# EAGLE design sensor-board_v1_23 (EAGLE 7.6.0)
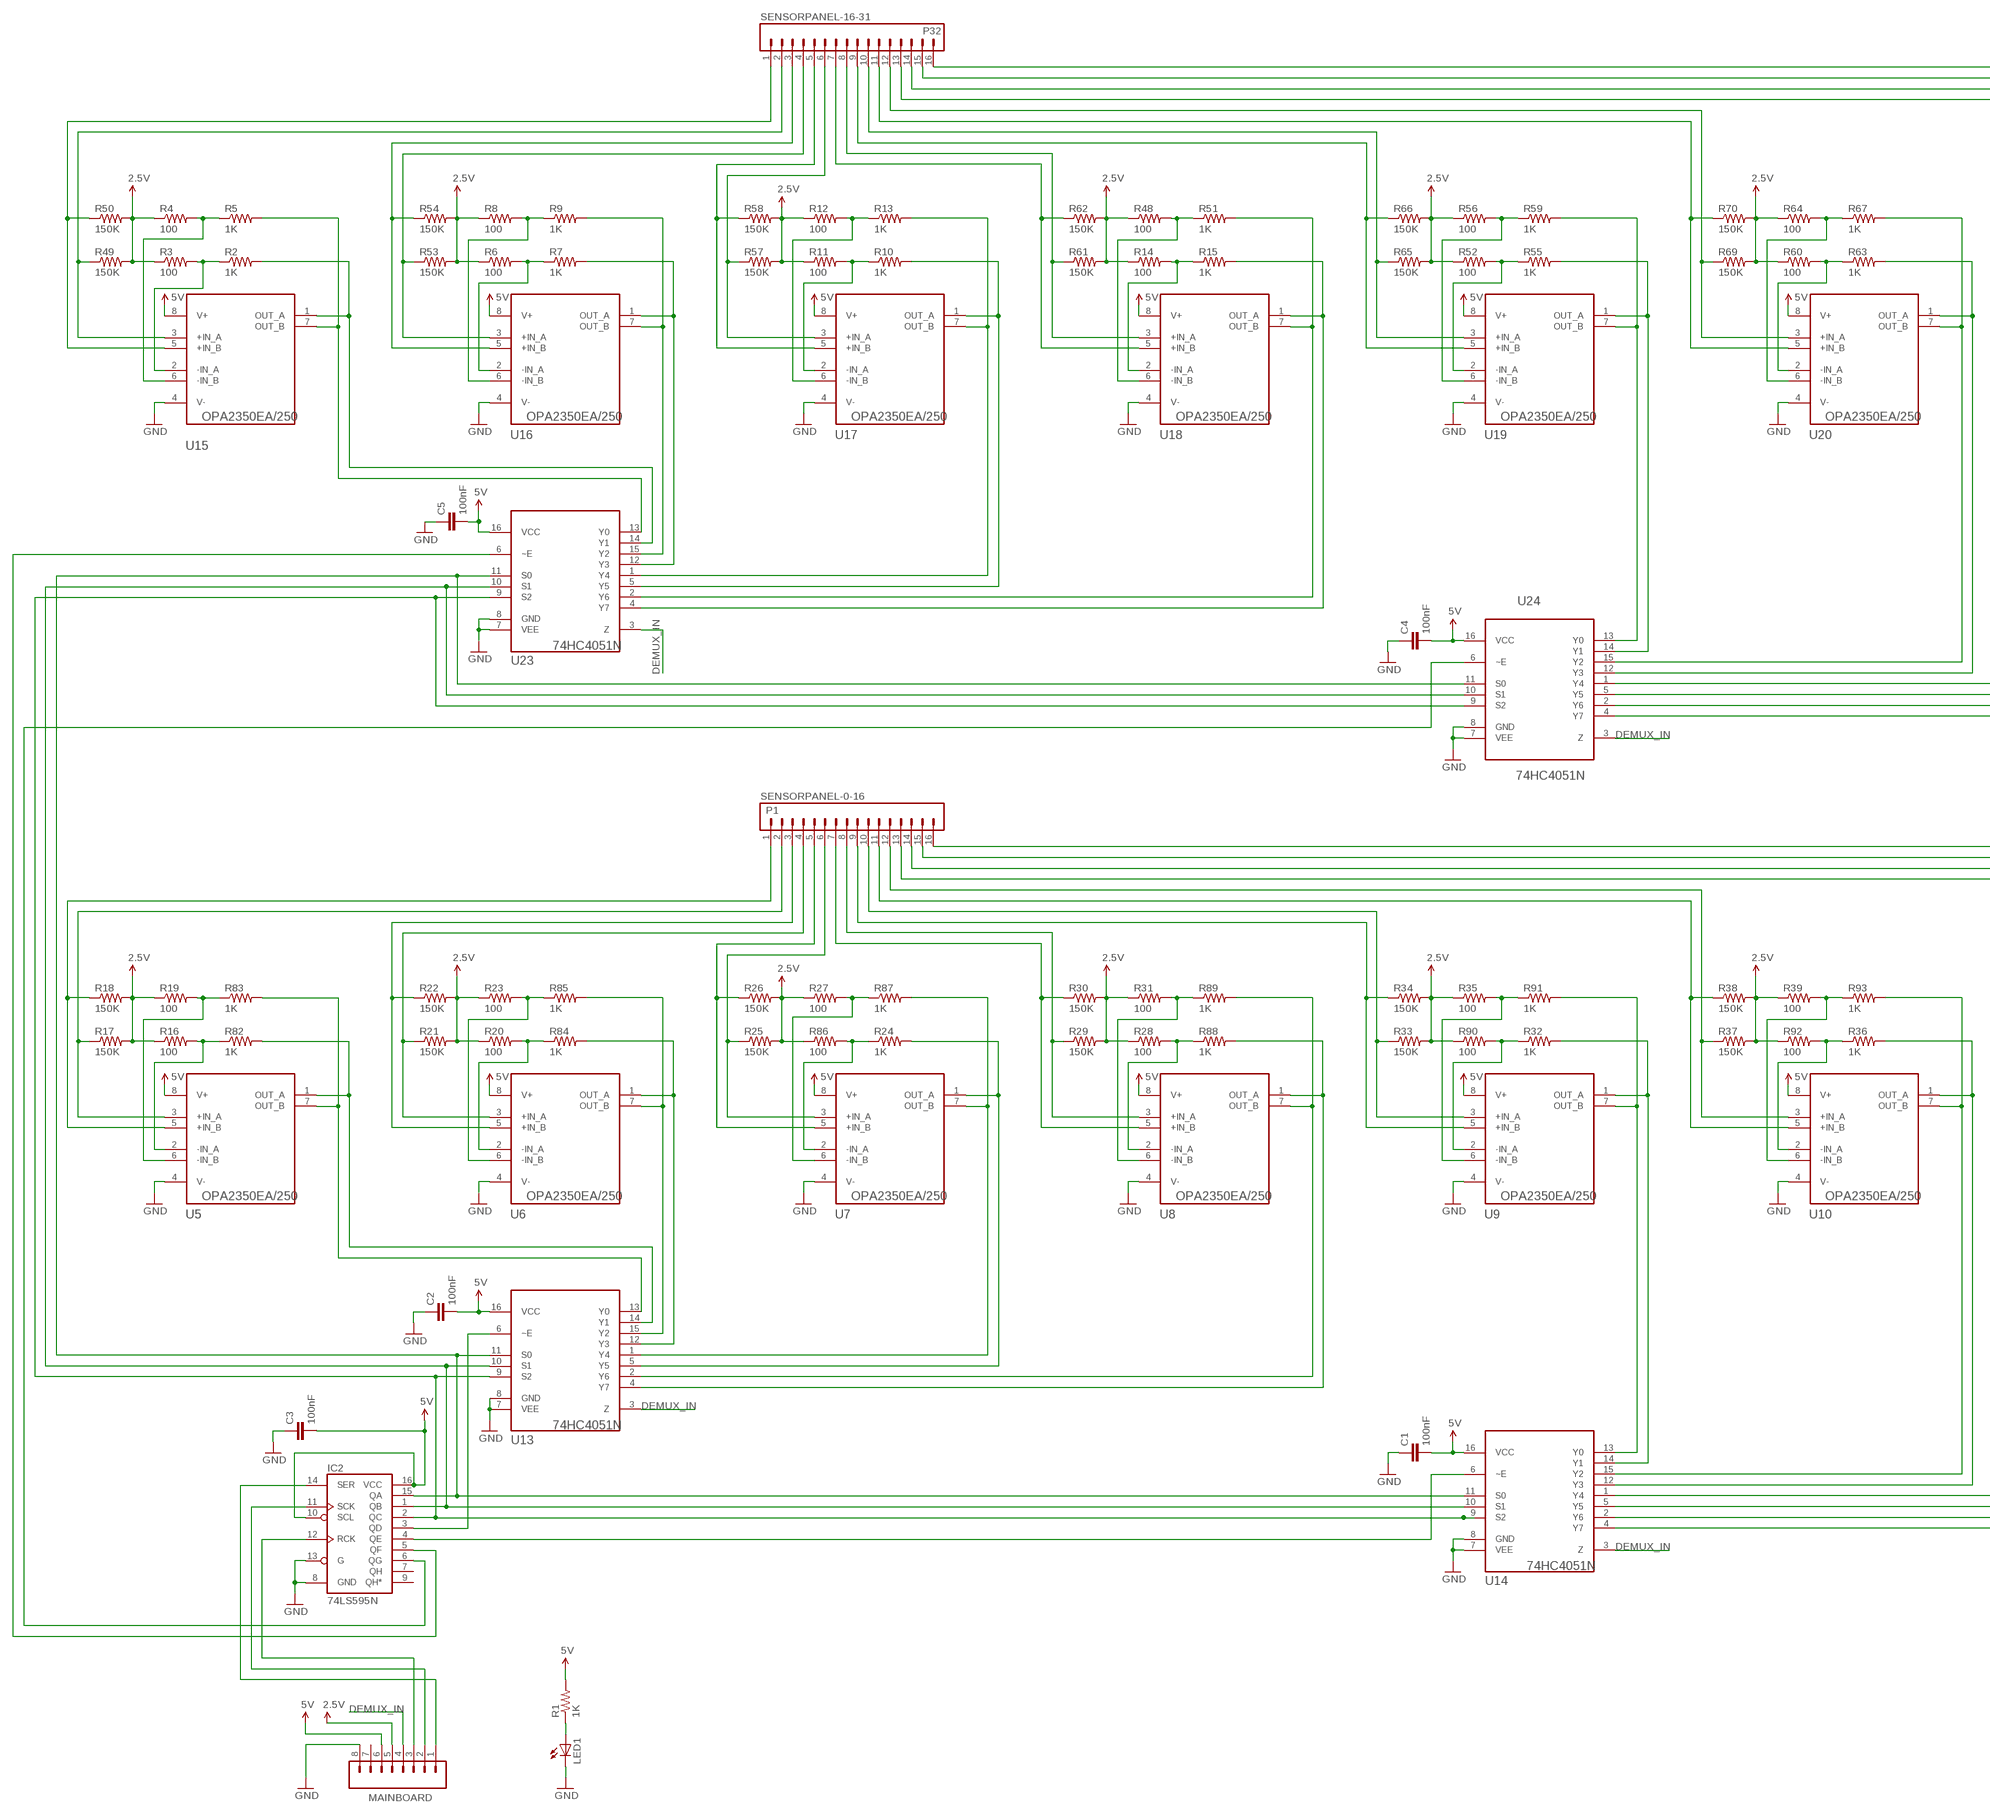
[diagram p0: schematic, sheet 1, part 1 of 2]
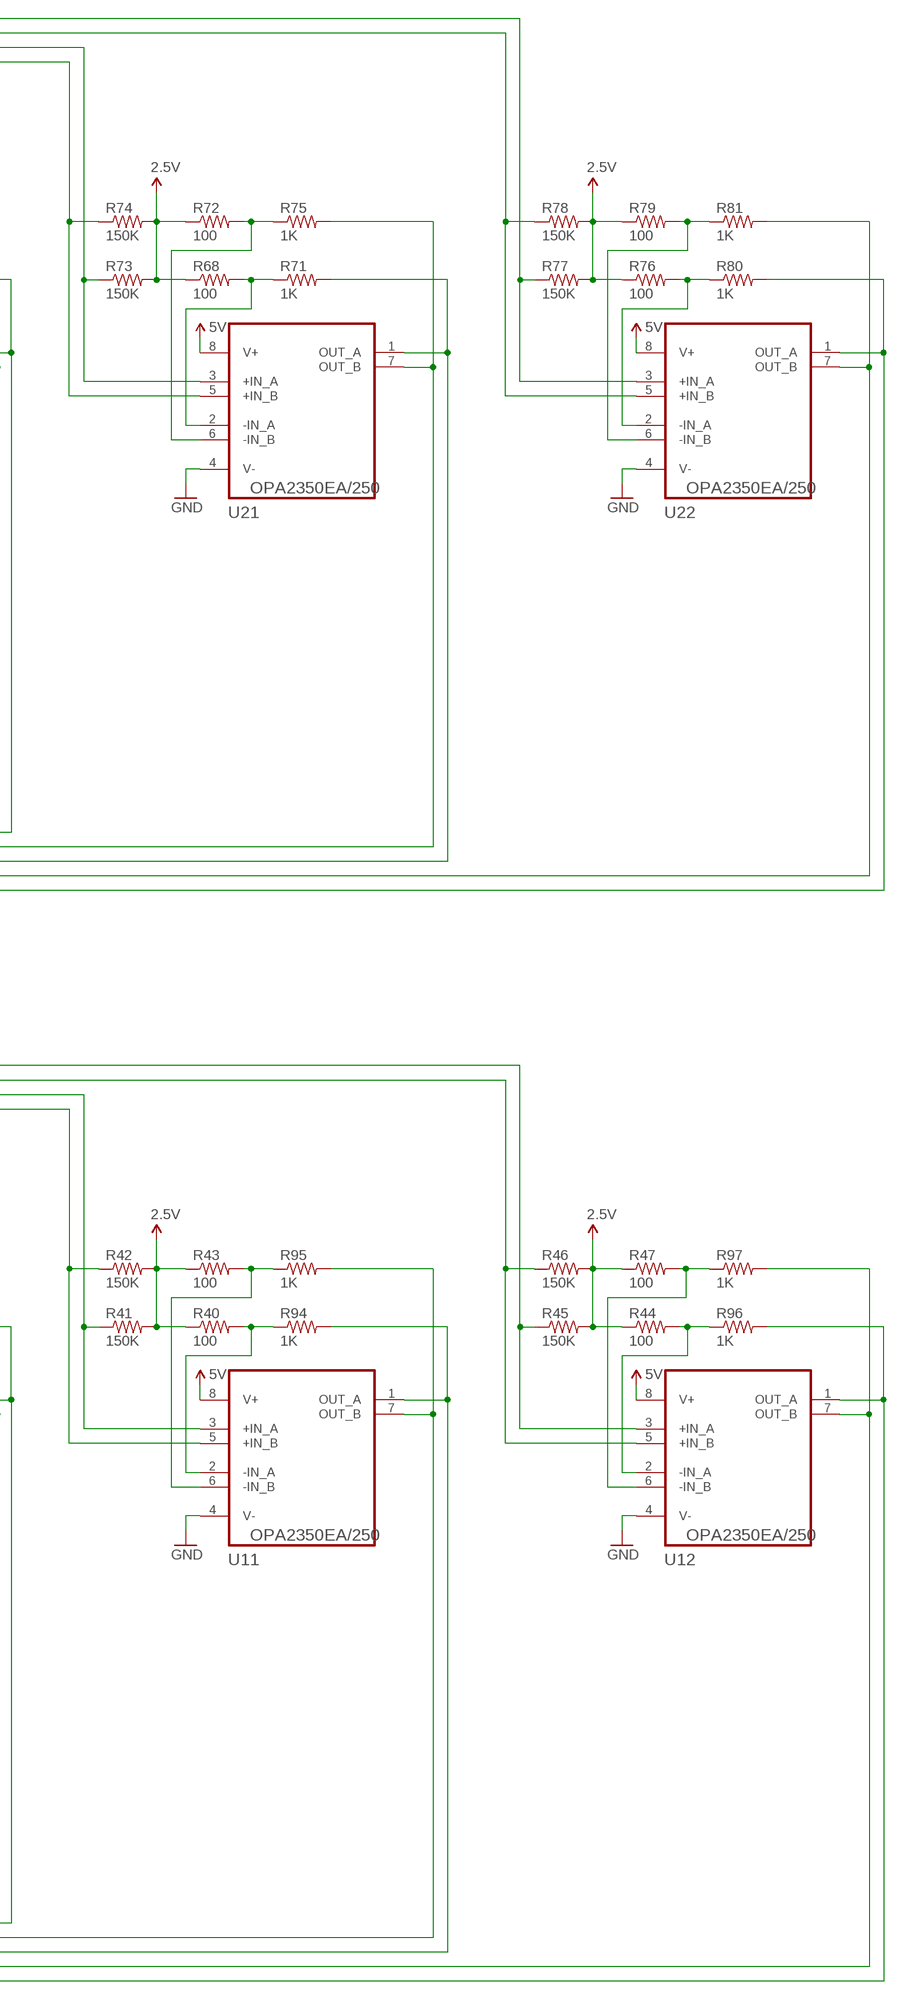
[diagram p1: schematic, sheet 1, part 2 of 2]

## Parts
C1  100nF  CAPPTH  [CAP-PTH-SMALL]
C2  100nF  CAPPTH  [CAP-PTH-SMALL]
C3  100nF  CAPPTH  [CAP-PTH-SMALL]
C4  100nF  CAPPTH  [CAP-PTH-SMALL]
C5  100nF  CAPPTH  [CAP-PTH-SMALL]
IC2  74LS595N  [DIL16]
LED1  LED0603  [LED-0603]
MAINBOARD  M08LONGPADS  [1X08_LONGPADS]
R1  1K  RESISTOR0805-RES  [0805]
R2  1K  RESISTOR0805-RES  [0805]
R3  100  RESISTOR0805-RES  [0805]
R4  100  RESISTOR0805-RES  [0805]
R5  1K  RESISTOR0805-RES  [0805]
R6  100  RESISTOR0805-RES  [0805]
R7  1K  RESISTOR0805-RES  [0805]
R8  100  RESISTOR0805-RES  [0805]
R9  1K  RESISTOR0805-RES  [0805]
R10  1K  RESISTOR0805-RES  [0805]
R11  100  RESISTOR0805-RES  [0805]
R12  100  RESISTOR0805-RES  [0805]
R13  1K  RESISTOR0805-RES  [0805]
R14  100  RESISTOR0805-RES  [0805]
R15  1K  RESISTOR0805-RES  [0805]
R16  100  RESISTOR0805-RES  [0805]
R17  150K  RESISTOR0805-RES  [0805]
R18  150K  RESISTOR0805-RES  [0805]
R19  100  RESISTOR0805-RES  [0805]
R20  100  RESISTOR0805-RES  [0805]
R21  150K  RESISTOR0805-RES  [0805]
R22  150K  RESISTOR0805-RES  [0805]
R23  100  RESISTOR0805-RES  [0805]
R24  1K  RESISTOR0805-RES  [0805]
R25  150K  RESISTOR0805-RES  [0805]
R26  150K  RESISTOR0805-RES  [0805]
R27  100  RESISTOR0805-RES  [0805]
R28  100  RESISTOR0805-RES  [0805]
R29  150K  RESISTOR0805-RES  [0805]
R30  150K  RESISTOR0805-RES  [0805]
R31  100  RESISTOR0805-RES  [0805]
R32  1K  RESISTOR0805-RES  [0805]
R33  150K  RESISTOR0805-RES  [0805]
R34  150K  RESISTOR0805-RES  [0805]
R35  100  RESISTOR0805-RES  [0805]
R36  1K  RESISTOR0805-RES  [0805]
R37  150K  RESISTOR0805-RES  [0805]
R38  150K  RESISTOR0805-RES  [0805]
R39  100  RESISTOR0805-RES  [0805]
R40  100  RESISTOR0805-RES  [0805]
R41  150K  RESISTOR0805-RES  [0805]
R42  150K  RESISTOR0805-RES  [0805]
R43  100  RESISTOR0805-RES  [0805]
R44  100  RESISTOR0805-RES  [0805]
R45  150K  RESISTOR0805-RES  [0805]
R46  150K  RESISTOR0805-RES  [0805]
R47  100  RESISTOR0805-RES  [0805]
R48  100  RESISTOR0805-RES  [0805]
R49  150K  RESISTOR0805-RES  [0805]
R50  150K  RESISTOR0805-RES  [0805]
R51  1K  RESISTOR0805-RES  [0805]
R52  100  RESISTOR0805-RES  [0805]
R53  150K  RESISTOR0805-RES  [0805]
R54  150K  RESISTOR0805-RES  [0805]
R55  1K  RESISTOR0805-RES  [0805]
R56  100  RESISTOR0805-RES  [0805]
R57  150K  RESISTOR0805-RES  [0805]
R58  150K  RESISTOR0805-RES  [0805]
R59  1K  RESISTOR0805-RES  [0805]
R60  100  RESISTOR0805-RES  [0805]
R61  150K  RESISTOR0805-RES  [0805]
R62  150K  RESISTOR0805-RES  [0805]
R63  1K  RESISTOR0805-RES  [0805]
R64  100  RESISTOR0805-RES  [0805]
R65  150K  RESISTOR0805-RES  [0805]
R66  150K  RESISTOR0805-RES  [0805]
R67  1K  RESISTOR0805-RES  [0805]
R68  100  RESISTOR0805-RES  [0805]
R69  150K  RESISTOR0805-RES  [0805]
R70  150K  RESISTOR0805-RES  [0805]
R71  1K  RESISTOR0805-RES  [0805]
R72  100  RESISTOR0805-RES  [0805]
R73  150K  RESISTOR0805-RES  [0805]
R74  150K  RESISTOR0805-RES  [0805]
R75  1K  RESISTOR0805-RES  [0805]
R76  100  RESISTOR0805-RES  [0805]
R77  150K  RESISTOR0805-RES  [0805]
R78  150K  RESISTOR0805-RES  [0805]
R79  100  RESISTOR0805-RES  [0805]
R80  1K  RESISTOR0805-RES  [0805]
R81  1K  RESISTOR0805-RES  [0805]
R82  1K  RESISTOR0805-RES  [0805]
R83  1K  RESISTOR0805-RES  [0805]
R84  1K  RESISTOR0805-RES  [0805]
R85  1K  RESISTOR0805-RES  [0805]
R86  100  RESISTOR0805-RES  [0805]
R87  1K  RESISTOR0805-RES  [0805]
R88  1K  RESISTOR0805-RES  [0805]
R89  1K  RESISTOR0805-RES  [0805]
R90  100  RESISTOR0805-RES  [0805]
R91  1K  RESISTOR0805-RES  [0805]
R92  100  RESISTOR0805-RES  [0805]
R93  1K  RESISTOR0805-RES  [0805]
R94  1K  RESISTOR0805-RES  [0805]
R95  1K  RESISTOR0805-RES  [0805]
R96  1K  RESISTOR0805-RES  [0805]
R97  1K  RESISTOR0805-RES  [0805]
SENSORPANEL-0-16  P1  M16LOCK  [1X16_LOCK]
SENSORPANEL-16-31  P32  M16LOCK  [1X16_LOCK]
U5  OPA2350EA/250  [SOP65P490X110-8N]
U6  OPA2350EA/250  [SOP65P490X110-8N]
U7  OPA2350EA/250  [SOP65P490X110-8N]
U8  OPA2350EA/250  [SOP65P490X110-8N]
U9  OPA2350EA/250  [SOP65P490X110-8N]
U10  OPA2350EA/250  [SOP65P490X110-8N]
U11  OPA2350EA/250  [SOP65P490X110-8N]
U12  OPA2350EA/250  [SOP65P490X110-8N]
U13  74HC4051N  [DIP254P762X420-16]
U14  74HC4051N  [DIP254P762X420-16]
U15  OPA2350EA/250  [SOP65P490X110-8N]
U16  OPA2350EA/250  [SOP65P490X110-8N]
U17  OPA2350EA/250  [SOP65P490X110-8N]
U18  OPA2350EA/250  [SOP65P490X110-8N]
U19  OPA2350EA/250  [SOP65P490X110-8N]
U20  OPA2350EA/250  [SOP65P490X110-8N]
U21  OPA2350EA/250  [SOP65P490X110-8N]
U22  OPA2350EA/250  [SOP65P490X110-8N]
U23  74HC4051N  [DIP254P762X420-16]
U24  74HC4051N  [DIP254P762X420-16]

## Nets
2.8V: MAINBOARD.5 R3.1 R4.1 R6.1 R8.1 R11.1 R12.1 R14.1 R16.1 R17.2 R18.2 R19.1 R20.1 R21.2 R22.2 R23.1 R25.2 R26.2 R27.1 R28.1 R29.2 R30.2 R31.1 R33.2 R34.2 R35.1 R37.2 R38.2 R39.1 R40.1 R41.2 R42.2 R43.1 R44.1 R45.2 R46.2 R47.1 R48.1 R49.2 R50.2 R52.1 R53.2 R54.2 R56.1 R57.2 R58.2 R60.1 R61.2 R62.2 R64.1 R65.2 R66.2 R68.1 R69.2 R70.2 R72.1 R73.2 R74.2 R76.1 R77.2 R78.2 R79.1 R86.1 R90.1 R92.1 ; supply symbol labelled 2.5V
5V: C1.2 C2.2 C3.2 C4.2 C5.2 IC2.10(SCL) IC2.16(VCC) MAINBOARD.6 R1.2 U5.8(V+) U6.8(V+) U7.8(V+) U8.8(V+) U9.8(V+) U10.8(V+) U11.8(V+) U12.8(V+) U13.16(VCC) U14.16(VCC) U15.8(V+) U16.8(V+) U17.8(V+) U18.8(V+) U19.8(V+) U20.8(V+) U21.8(V+) U22.8(V+) U23.16(VCC) U24.16(VCC)
DEMUX_IN: MAINBOARD.4 U13.3(Z) U14.3(Z) U23.3(Z) U24.3(Z)
GND: C1.1 C2.1 C3.1 C4.1 C5.1 IC2.8(GND) IC2.13(G) LED1.C MAINBOARD.8 U5.4(V-) U6.4(V-) U7.4(V-) U8.4(V-) U9.4(V-) U10.4(V-) U11.4(V-) U12.4(V-) U13.7(VEE) U13.8(GND) U14.7(VEE) U14.8(GND) U15.4(V-) U16.4(V-) U17.4(V-) U18.4(V-) U19.4(V-) U20.4(V-) U21.4(V-) U22.4(V-) U23.7(VEE) U23.8(GND) U24.7(VEE) U24.8(GND)
N$1: LED1.A R1.1
N$2: R2.1 R3.2 U15.2(-IN_A)
N$3: R4.2 R5.1 U15.6(-IN_B)
N$4: R6.2 R7.1 U16.2(-IN_A)
N$5: R8.2 R9.1 U16.6(-IN_B)
N$6: R10.1 R11.2 U17.2(-IN_A)
N$7: R12.2 R13.1 U17.6(-IN_B)
N$8: R14.2 R15.1 U18.2(-IN_A)
N$9: R48.2 R51.1 U18.6(-IN_B)
N$10: R52.2 R55.1 U19.2(-IN_A)
N$11: R56.2 R59.1 U19.6(-IN_B)
N$12: R60.2 R63.1 U20.2(-IN_A)
N$13: R64.2 R67.1 U20.6(-IN_B)
N$14: R68.2 R71.1 U21.2(-IN_A)
N$15: R72.2 R75.1 U21.6(-IN_B)
N$16: R76.2 R80.1 U22.2(-IN_A)
N$17: R79.2 R81.1 U22.6(-IN_B)
N$18: R16.2 R82.1 U5.2(-IN_A)
N$19: R19.2 R83.1 U5.6(-IN_B)
N$20: R20.2 R84.1 U6.2(-IN_A)
N$21: R23.2 R85.1 U6.6(-IN_B)
N$22: R24.1 R86.2 U7.2(-IN_A)
N$23: R27.2 R87.1 U7.6(-IN_B)
N$24: R82.2 U5.1(OUT_A) U13.14(Y1)
N$25: R83.2 U5.7(OUT_B) U13.13(Y0)
N$26: R84.2 U6.1(OUT_A) U13.12(Y3)
N$27: R28.2 R88.1 U8.2(-IN_A)
N$28: R17.1 SENSORPANEL-0-16.2 U5.3(+IN_A)
N$29: R18.1 SENSORPANEL-0-16.1 U5.5(+IN_B)
N$30: R31.2 R89.1 U8.6(-IN_B)
N$31: R85.2 U6.7(OUT_B) U13.15(Y2)
N$32: R32.1 R90.2 U9.2(-IN_A)
N$33: R21.1 SENSORPANEL-0-16.4 U6.3(+IN_A)
N$34: R22.1 SENSORPANEL-0-16.3 U6.5(+IN_B)
N$35: R35.2 R91.1 U9.6(-IN_B)
N$36: R24.2 U7.1(OUT_A) U13.5(Y5)
N$37: R87.2 U7.7(OUT_B) U13.1(Y4)
N$38: R36.1 R92.2 U10.2(-IN_A)
N$39: R25.1 SENSORPANEL-0-16.6 U7.3(+IN_A)
N$40: R26.1 SENSORPANEL-0-16.5 U7.5(+IN_B)
N$41: R39.2 R93.1 U10.6(-IN_B)
N$42: R88.2 U8.1(OUT_A) U13.4(Y7)
N$43: R89.2 U8.7(OUT_B) U13.2(Y6)
N$44: R40.2 R94.1 U11.2(-IN_A)
N$45: R32.2 U9.1(OUT_A) U14.14(Y1)
N$46: R30.1 SENSORPANEL-0-16.7 U8.5(+IN_B)
N$47: R44.2 R96.1 U12.2(-IN_A)
N$48: R29.1 SENSORPANEL-0-16.8 U8.3(+IN_A)
N$49: R91.2 U9.7(OUT_B) U14.13(Y0)
N$50: R47.2 R97.1 U12.6(-IN_B)
N$51: R34.1 SENSORPANEL-0-16.9 U9.5(+IN_B)
N$53: R33.1 SENSORPANEL-0-16.10 U9.3(+IN_A)
N$54: R36.2 U10.1(OUT_A) U14.12(Y3)
N$55: R93.2 U10.7(OUT_B) U14.15(Y2)
N$57: R38.1 SENSORPANEL-0-16.11 U10.5(+IN_B)
N$59: R37.1 SENSORPANEL-0-16.12 U10.3(+IN_A)
N$60: R94.2 U11.1(OUT_A) U14.5(Y5)
N$61: R95.2 U11.7(OUT_B) U14.1(Y4)
N$63: R42.1 SENSORPANEL-0-16.13 U11.5(+IN_B)
N$64: R43.2 R95.1 U11.6(-IN_B)
N$65: R41.1 SENSORPANEL-0-16.14 U11.3(+IN_A)
N$66: R96.2 U12.1(OUT_A) U14.4(Y7)
N$67: R97.2 U12.7(OUT_B) U14.2(Y6)
N$69: R46.1 SENSORPANEL-0-16.15 U12.5(+IN_B)
N$71: R45.1 SENSORPANEL-0-16.16 U12.3(+IN_A)
N$72: R2.2 U15.1(OUT_A) U23.14(Y1)
N$73: IC2.15(QA) U13.11(S0) U14.11(S0) U23.11(S0) U24.11(S0)
N$74: IC2.1(QB) U13.10(S1) U14.10(S1) U23.10(S1) U24.10(S1)
N$75: IC2.2(QC) U13.9(S2) U14.9(S2) U23.9(S2) U24.9(S2)
N$76: IC2.3(QD) U13.6(~E)
N$77: IC2.4(QE) U14.6(~E)
N$78: R5.2 U15.7(OUT_B) U23.13(Y0)
N$80: R49.1 SENSORPANEL-16-31.2 U15.3(+IN_A)
N$81: R50.1 SENSORPANEL-16-31.1 U15.5(+IN_B)
N$83: R7.2 U16.1(OUT_A) U23.12(Y3)
N$84: R9.2 U16.7(OUT_B) U23.15(Y2)
N$86: R53.1 SENSORPANEL-16-31.4 U16.3(+IN_A)
N$87: R54.1 SENSORPANEL-16-31.3 U16.5(+IN_B)
N$89: R10.2 U17.1(OUT_A) U23.5(Y5)
N$90: R13.2 U17.7(OUT_B) U23.1(Y4)
N$92: R57.1 SENSORPANEL-16-31.6 U17.3(+IN_A)
N$93: R58.1 SENSORPANEL-16-31.5 U17.5(+IN_B)
N$95: R15.2 U18.1(OUT_A) U23.4(Y7)
N$96: R51.2 U18.7(OUT_B) U23.2(Y6)
N$98: R62.1 SENSORPANEL-16-31.7 U18.5(+IN_B)
N$100: R61.1 SENSORPANEL-16-31.8 U18.3(+IN_A)
N$101: R55.2 U19.1(OUT_A) U24.14(Y1)
N$102: R59.2 U19.7(OUT_B) U24.13(Y0)
N$104: R66.1 SENSORPANEL-16-31.9 U19.5(+IN_B)
N$106: R65.1 SENSORPANEL-16-31.10 U19.3(+IN_A)
N$107: R63.2 U20.1(OUT_A) U24.12(Y3)
N$108: R67.2 U20.7(OUT_B) U24.15(Y2)
N$110: R70.1 SENSORPANEL-16-31.11 U20.5(+IN_B)
N$112: R69.1 SENSORPANEL-16-31.12 U20.3(+IN_A)
N$113: R71.2 U21.1(OUT_A) U24.5(Y5)
N$114: R75.2 U21.7(OUT_B) U24.1(Y4)
N$116: R74.1 SENSORPANEL-16-31.13 U21.5(+IN_B)
N$118: R73.1 SENSORPANEL-16-31.14 U21.3(+IN_A)
N$119: R80.2 U22.1(OUT_A) U24.4(Y7)
N$120: R81.2 U22.7(OUT_B) U24.2(Y6)
N$122: R78.1 SENSORPANEL-16-31.15 U22.5(+IN_B)
N$124: R77.1 SENSORPANEL-16-31.16 U22.3(+IN_A)
N$125: IC2.5(QF) U23.6(~E)
N$126: IC2.6(QG) U24.6(~E)
N$127: IC2.12(RCK) MAINBOARD.3
SHIFT_CLK: IC2.11(SCK) MAINBOARD.2
SHIFT_SER: IC2.14(SER) MAINBOARD.1
Unconnected: IC2.7(QH) IC2.9(QH*) MAINBOARD.7

## Library data of the parts
C1-C5 = SparkFun-Passives:CAP: Capacitor Standard 0603 ceramic capacitor, and 0.1" leaded capacitor.
IC2 = SparkFun-DigitalIC:74*595: 8-bit SHIFT REGISTER, output latch
LED1 = SparkFun-LED:LED: LEDs Standard schematic elements and footprints for 5mm, 3mm, 1206, and 0603 sized LEDs. 5mm - Spark Fun Electronics SKU : COM-00529 (and others)
MAINBOARD = SparkFun-Connectors:M08: Header 8 Standard 8-pin 0.1" header. Use with straight break away headers (SKU : PRT-00116), right angle break away headers (PRT-00553), swiss pins (PRT-00743), machine pins (PRT-00117), and female headers (PRT-00115).
R1-R97 = SparkFun-Passives:RESISTOR: Resistor Basic schematic elements and footprints for 0603, 1206, and PTH resistors.
SENSORPANEL-0-16 SENSORPANEL-16-31 = SparkFun-Connectors:M16: 1x16 .1" header
U5-U12 U15-U22 = gkaindl:OPA2350EA/250: OPERATIONAL AMPLIFIERS; MPN: OPA2350EA/250; OC_FARNELL: 1459568; OC_NEWARK: 74K3902; PACKAGE: MSOP-8; SUPPLIER: Texas Instruments
U13 U14 U23 U24 = gkaindl:74HC4051N: 8-channel analog multiplexer/demultiplexer; MPN: 74HC4051N; OC_FARNELL: 380910; OC_NEWARK: 07WX3738; PACKAGE: DIP-16; SUPPLIER: NXP

## Board
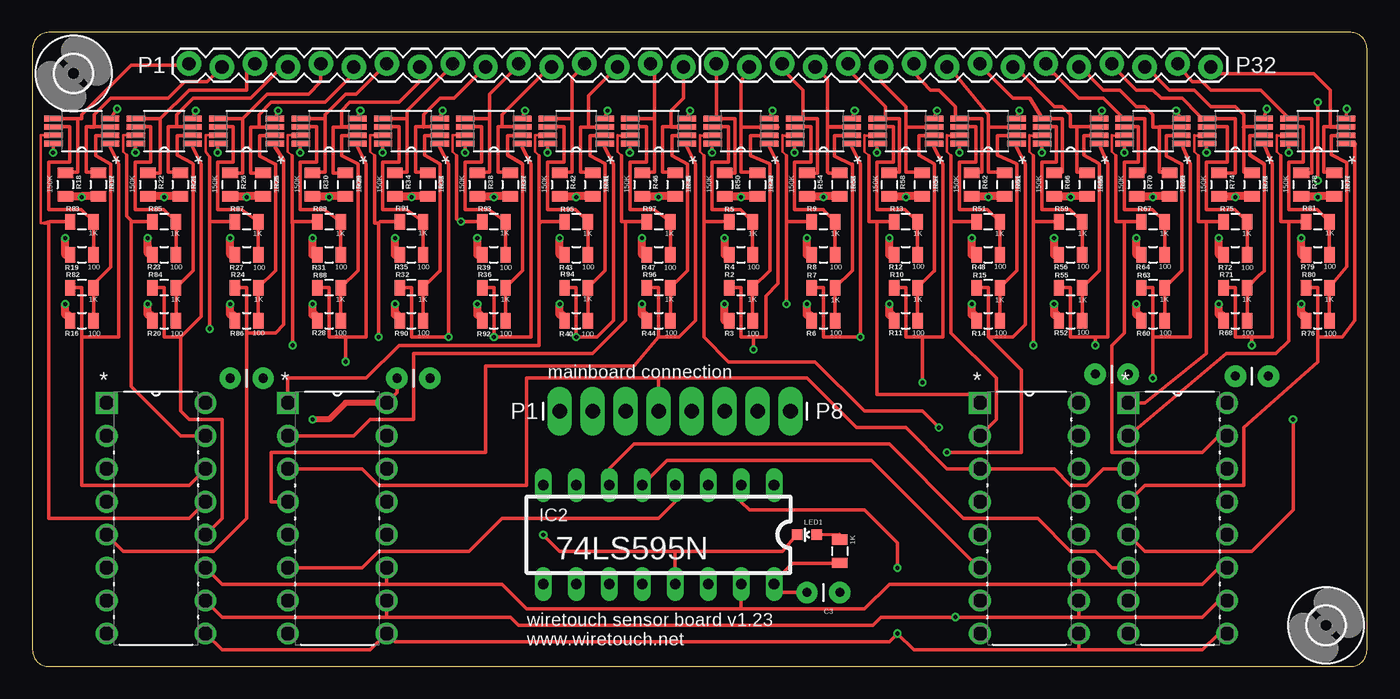
[diagram p2: board, top side]
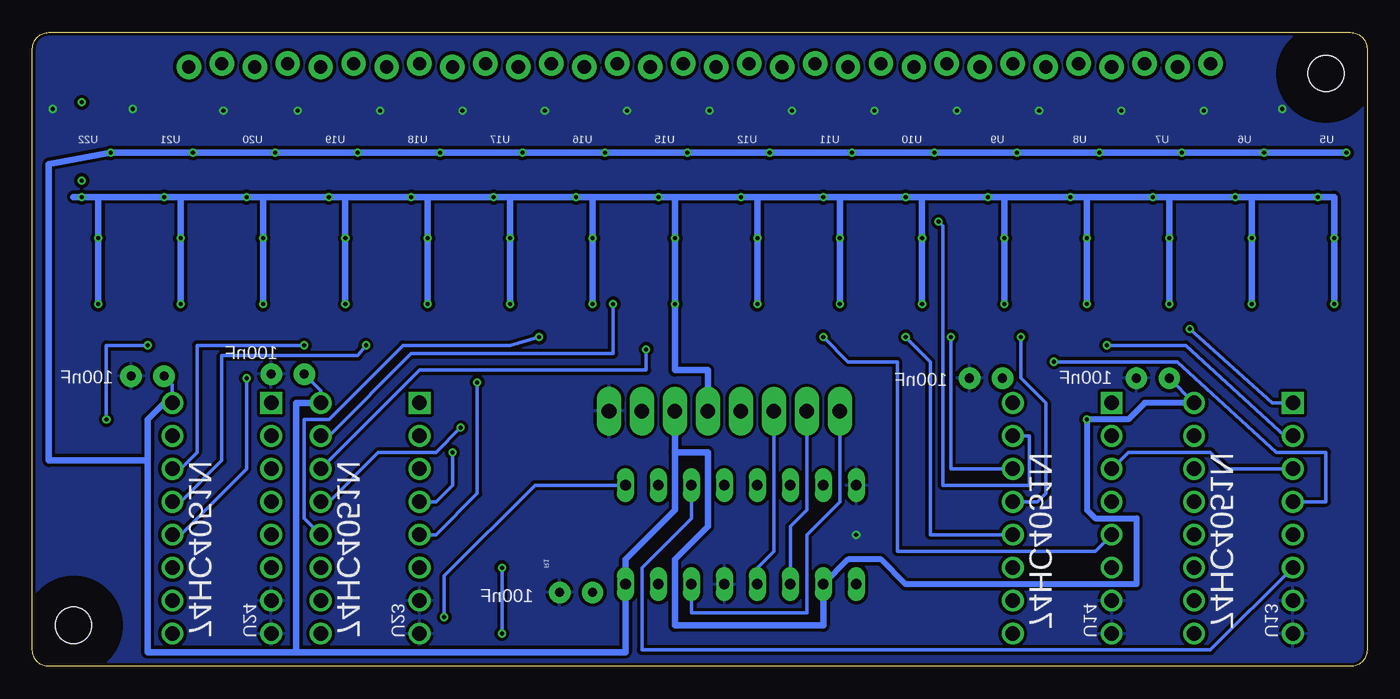
[diagram p3: board, bottom side, seen from below]

Size 102.86 x 48.88 mm. Coordinates in mm from the lower left corner, seen from the top.
Outline: 0,47.62 0,1.27 arc90 1.27,0 101.59,0 arc90 102.86,1.27 102.86,47.62 arc90 101.59,48.88 1.27,48.88 arc90 0,47.62
Copper layers (1*16): Top 0.035mm / dielectric 1.5mm / Bottom 0.035mm
Design rules "Fusion_eagle_rule_v1.1": minimum track width 6mil, minimum drill 12mil, track to track 6mil, track to pad 6mil, pad to pad 6mil, via to via 6mil, smd to smd 0mil, copper to edge 10mil, drill to drill 10mil, minimum pad ring 10mil, minimum via ring 6mil, stop-mask expansion 2mil, vias tented up to drill 100mil, thermal gap 10mil

### Footprints (pad centres in the part's own frame; a part is rotated, then mirrored left to right if it is on the bottom)
CAP-PTH-SMALL = drill 0.7 pad 1.651: 1 0,0; 2 2.54,0
DIL16 = drill 0.813 long: 1 -8.89,-3.81; 2 -6.35,-3.81; 3 -3.81,-3.81; 4 -1.27,-3.81; 5 1.27,-3.81; 6 3.81,-3.81; 7 6.35,-3.81; 8 8.89,-3.81; 9 8.89,3.81; 10 6.35,3.81; 11 3.81,3.81; 12 1.27,3.81; 13 -1.27,3.81; 14 -3.81,3.81; 15 -6.35,3.81; 16 -8.89,3.81
LED-0603 = smd 0.8 x 0.8: A 0,-0.75; C 0,0.75
1X08_LONGPADS = drill 1.118 pad 1.88 long: 1 0,0; 2 2.54,0; 3 5.08,0; 4 7.62,0; 5 10.16,0; 6 12.7,0; 7 15.24,0; 8 17.78,0
0805 = smd 0.8 x 1.2: 1 -0.9,0; 2 0.9,0
1X16_LOCK = drill 1.016 pad 1.88: 1 0,0.127; 2 2.54,-0.127; 3 5.08,0.127; 4 7.62,-0.127; 5 10.16,0.127; 6 12.7,-0.127; 7 15.24,0.127; 8 17.78,-0.127; 9 20.32,0.127; 10 22.86,-0.127; 11 25.4,0.127; 12 27.94,-0.127; 13 30.48,0.127; 14 33.02,-0.127; 15 35.56,0.127; 16 38.1,-0.127
SOP65P490X110-8N = smd 1.422 x 0.432: 1 -2.184,0.965; 2 -2.184,0.33; 3 -2.184,-0.33; 4 -2.184,-0.965; 5 2.184,-0.965; 6 2.184,-0.33; 7 2.184,0.33; 8 2.184,0.965
DIP254P762X420-16 = drill 1.118 square: 1 -7.62,17.78 | drill 1.118: 2 -7.62,15.24; 3 -7.62,12.7; 4 -7.62,10.16; 5 -7.62,7.62; 6 -7.62,5.08; 7 -7.62,2.54; 8 -7.62,0; 9 0,0; 10 0,2.54; 11 0,5.08; 12 0,7.62; 13 0,10.16; 14 0,12.7; 15 0,15.24; 16 0,17.78
2,8 = hole 2.8: 0,0

### Placement (x,y rotation side)
C1  30.64,22.23 180 top
C2  17.78,22.23 180 top
C3  62.23,5.71 180 top
C4  95.25,22.38 180 top
C5  84.45,22.54 180 top
IC2  48.26,10.16 180 top
LED1  59.69,10.16 90 top
MAINBOARD  40.64,19.68 0 top
R1  62.23,8.89 270 top
R2  54.61,29.21 180 top
R3  54.61,26.67 0 top
R4  54.61,31.75 0 top
R5  54.61,34.29 180 top
R6  60.96,26.67 0 top
R7  60.96,29.21 180 top
R8  60.96,31.75 0 top
R9  60.96,34.29 180 top
R10  67.31,29.21 180 top
R11  67.31,26.67 0 top
R12  67.31,31.75 0 top
R13  67.31,34.29 180 top
R14  73.66,26.67 0 top
R15  73.66,29.21 180 top
R16  3.81,26.67 0 top
R17  5.08,37.15 270 top
R18  2.54,37.15 270 top
R19  3.81,31.75 0 top
R20  10.16,26.67 0 top
R21  11.39,37.15 270 top
R22  8.89,37.15 270 top
R23  10.16,31.75 0 top
R24  16.51,29.21 180 top
R25  17.78,37.15 270 top
R26  15.24,37.15 270 top
R27  16.51,31.75 0 top
R28  22.86,26.67 0 top
R29  24.13,37.15 270 top
R30  21.59,37.15 270 top
R31  22.86,31.75 0 top
R32  29.21,29.21 180 top
R33  30.48,37.15 270 top
R34  27.94,37.15 270 top
R35  29.21,31.75 0 top
R36  35.56,29.21 180 top
R37  36.83,37.15 270 top
R38  34.29,37.15 270 top
R39  35.56,31.75 0 top
R40  41.91,26.67 0 top
R41  43.18,37.15 270 top
R42  40.64,37.15 270 top
R43  41.91,31.75 0 top
R44  48.26,26.67 0 top
R45  49.53,37.15 270 top
R46  46.99,37.15 270 top
R47  48.26,31.75 0 top
R48  73.66,31.75 0 top
R49  55.88,37.15 270 top
R50  53.34,37.15 270 top
R51  73.66,34.29 180 top
R52  80.01,26.67 0 top
R53  62.23,37.15 270 top
R54  59.69,37.15 270 top
R55  80.01,29.21 180 top
R56  80.01,31.75 0 top
R57  68.58,37.15 270 top
R58  66.04,37.15 270 top
R59  80.01,34.29 180 top
R60  86.36,26.67 0 top
R61  74.93,37.15 270 top
R62  72.39,37.15 270 top
R63  86.36,29.21 180 top
R64  86.36,31.75 0 top
R65  81.28,37.15 270 top
R66  78.74,37.15 270 top
R67  86.36,34.29 180 top
R68  92.71,26.67 0 top
R69  87.63,37.15 270 top
R70  85.09,37.15 270 top
R71  92.71,29.21 180 top
R72  92.71,31.75 0 top
R73  93.98,37.15 270 top
R74  91.44,37.15 270 top
R75  92.71,34.29 180 top
R76  99.06,26.67 0 top
R77  100.33,37.15 270 top
R78  97.79,37.15 270 top
R79  99.06,31.75 0 top
R80  99.06,29.21 180 top
R81  99.06,34.29 180 top
R82  3.81,29.21 180 top
R83  3.81,34.29 180 top
R84  10.16,29.21 180 top
R85  10.16,34.29 180 top
R86  16.51,26.67 0 top
R87  16.51,34.29 180 top
R88  22.86,29.21 180 top
R89  22.86,34.29 180 top
R90  29.21,26.67 0 top
R91  29.21,34.29 180 top
R92  35.56,26.67 0 top
R93  35.56,34.29 180 top
R94  41.91,29.21 180 top
R95  41.91,34.29 180 top
R96  48.26,29.21 180 top
R97  48.26,34.29 180 top
SENSORPANEL-0-16  12.06,46.35 0 top
SENSORPANEL-16-31  52.7,46.35 0 top
U5  3.81,41.27 180 top
U6  10.16,41.27 180 top
U7  16.51,41.27 180 top
U8  22.86,41.27 180 top
U9  29.21,41.27 180 top
U10  35.56,41.27 180 top
U11  41.91,41.27 180 top
U12  48.26,41.27 180 top
U13  13.34,2.54 0 top
U14  27.3,2.54 0 top
U15  54.61,41.27 180 top
U16  60.96,41.27 180 top
U17  67.31,41.27 180 top
U18  73.66,41.27 180 top
U19  80.01,41.27 180 top
U20  86.36,41.27 180 top
U21  92.71,41.27 180 top
U22  99.06,41.27 180 top
U23  80.64,2.54 0 top
U24  92.08,2.54 0 top
U$1  [2,8]  3.17,45.72 0 top
U$2  [2,8]  99.69,3.17 0 top

### Tracks (layer width: path | path; a pad name or v marks a point on that pad's centre or on a via)
2.8V  (via drill 0.32)
  Top 0.254: R17.2 5.08,36.2 | v10.16,36.2 11.75,36.2 R21.2 | 3.81,36.25 v3.81,36.2 | 16.51,36.25 v16.51,36.2 | 22.86,36.25 v22.86,36.2 | 29.21,36.25 v29.21,36.2 | 35.56,36.25 v35.56,36.2 | 41.91,36.25 v41.91,36.2 | 48.26,36.25 v48.26,36.2 | 54.61,36.25 v54.61,36.2 | 60.96,36.25 v60.96,36.2 | 67.31,36.25 v67.31,36.2 | 73.66,36.25 v73.66,36.2 | 80.01,36.25 v80.01,36.2 | 86.36,36.25 v86.36,36.2 | 92.71,36.25 v92.71,36.2 | 99.06,36.25 v99.06,36.2 | 34.29,31.86 v34.29,33.02 | 40.64,31.86 v40.64,33.02 | 46.99,31.86 v46.99,33.02 | 53.34,31.86 v53.34,33.02 | 59.69,31.86 v59.69,33.02 | 66.04,31.86 v66.04,33.02 | 72.39,31.86 v72.39,33.02 | 78.74,31.86 v78.74,33.02 | 85.09,31.86 v85.09,33.02 | 91.44,31.86 v91.44,33.02 | 97.79,31.86 v97.79,33.02 | R3.1 53.34,26.67 | 53.34,31.75 R4.1 | R6.1 60.06,26.93 | R8.1 59.69,31.75 | R11.1 66.41,26.93 | R12.1 66.04,31.75 | R48.1 72.39,31.75 | R52.1 79.11,26.93 | R56.1 78.74,31.75 | R60.1 85.46,26.93 | R64.1 85.09,31.75 | R68.1 91.81,26.93 | R72.1 91.44,31.75 | R76.1 98.16,26.93 | R79.1 97.79,31.75 | R16.1 2.91,26.93 | R19.1 2.54,31.75 | R23.1 9.26,32.02 8.89,32.38 | R86.1 15.61,26.93 | R27.1 15.24,31.75 | R28.1 21.96,26.93 | R31.1 21.59,31.75 | R90.1 28.31,26.93 | R35.1 27.94,31.75 | R92.1 34.66,26.93 | R39.1 34.29,31.75 | R40.1 41.01,26.93 | R43.1 40.64,31.75 | R47.1 46.99,31.75
  Top 0.61: R18.2 3.81,36.25 R17.2 | R21.2 R22.2 | R25.2 16.51,36.25 R26.2 | R29.2 22.86,36.25 R30.2 | R33.2 29.21,36.25 R34.2 | R38.2 35.56,36.25 R37.2 | R42.2 41.91,36.25 R41.2 | R46.2 48.26,36.25 R45.2 | R50.2 54.61,36.25 R49.2 | R54.2 60.96,36.25 R53.2 | R58.2 67.31,36.25 R57.2 | R62.2 73.66,36.25 R61.2 | R66.2 80.01,36.25 R65.2 | R70.2 86.36,36.25 R69.2 | R74.2 92.71,36.25 R73.2 | R78.2 99.06,36.25 R77.2 | 2.54,27.1 2.54,27.3 | 2.54,27.3 v2.54,27.94 | 2.54,31.75 v2.54,33.02 | 8.89,27.1 8.89,27.3 | 8.89,27.3 v8.89,27.94 | 8.89,31.86 8.89,32.38 v8.89,33.02 | 15.24,27.1 15.24,27.3 | 15.24,27.3 v15.24,27.94 | 15.24,31.75 v15.24,33.02 | 21.59,27.1 21.59,27.3 | 21.59,27.3 v21.59,27.94 | 21.59,31.75 v21.59,33.02 | 27.94,27.1 27.94,27.3 | 27.94,27.3 v27.94,27.94 | 27.94,31.75 v27.94,33.02 | 34.29,27.1 34.29,27.3 | 34.29,27.3 v34.29,27.94 | 40.64,27.1 40.64,27.3 | 40.64,27.3 v40.64,27.94 | 46.99,27.1 46.99,27.3 | 46.99,27.3 v46.99,27.94 | 53.34,26.67 v53.34,27.94 | 59.69,27.1 59.69,27.3 | 59.69,27.3 v59.69,27.94 | 66.04,27.1 66.04,27.3 | 66.04,27.3 v66.04,27.94 | 72.39,27.1 72.39,27.3 | 72.39,27.3 v72.39,27.94 | 78.74,27.1 78.74,27.3 | 78.74,27.3 v78.74,27.94 | 85.09,27.1 85.09,27.3 | 85.09,27.3 v85.09,27.94 | 91.44,27.1 91.44,27.3 | 91.44,27.3 v91.44,27.94 | 97.79,27.1 97.79,27.3 | 97.79,27.3 v97.79,27.94 | v53.34,33.02 53.34,31.75 | 60.06,26.93 59.69,27.3 | 59.69,31.75 v59.69,33.02 | 66.41,26.93 66.04,27.3 | 66.04,31.75 v66.04,33.02 | R14.1 72.76,26.93 72.39,27.3 | 72.39,31.75 v72.39,33.02 | 79.11,26.93 78.74,27.3 | 78.74,31.75 v78.74,33.02 | 85.46,26.93 85.09,27.3 | 85.09,31.75 v85.09,33.02 | 91.81,26.93 91.44,27.3 | 91.44,31.75 v91.44,33.02 | 98.16,26.93 97.79,27.3 | 97.79,31.75 v97.79,33.02
  Top 0.61: 2.91,26.93 2.54,27.3 | R20.1 9.26,26.93 8.89,27.3 | 15.61,26.93 15.24,27.3 | 21.96,26.93 21.59,27.3 | 28.31,26.93 27.94,27.3 | 34.66,26.93 34.29,27.3 | 34.29,31.75 v34.29,33.02 | 41.01,26.93 40.64,27.3 | 40.64,31.75 v40.64,33.02 | R44.1 47.36,26.93 46.99,27.3 | 46.99,31.75 v46.99,33.02
  Bottom 0.508: 8.89,36.2 v3.81,36.2 2.54,36.2 v2.54,33.02 v2.54,27.94 | 8.89,36.2 v10.16,36.2 15.24,36.2 | 15.24,36.2 v16.51,36.2 21.59,36.2 | 21.59,36.2 v22.86,36.2 27.94,36.2 | 27.94,36.2 v29.21,36.2 34.29,36.2 | 34.29,36.2 v35.56,36.2 40.64,36.2 | 40.64,36.2 v41.91,36.2 46.99,36.2 | 46.99,36.2 v48.26,36.2 53.34,36.2 | 53.34,36.2 v54.61,36.2 59.69,36.2 | 59.69,36.2 v60.96,36.2 66.04,36.2 | 66.04,36.2 v67.31,36.2 72.39,36.2 | 72.39,36.2 v73.66,36.2 78.74,36.2 | 78.74,36.2 v80.01,36.2 85.09,36.2 | 85.09,36.2 v86.36,36.2 91.44,36.2 | 91.44,36.2 v92.71,36.2 97.79,36.2 | 97.79,36.2 v99.06,36.2 99.69,36.2 | 8.89,36.2 v8.89,33.02 v8.89,27.94 | 15.24,36.2 v15.24,33.02 v15.24,27.94 | 21.59,36.2 v21.59,33.02 v21.59,27.94 | 27.94,36.2 v27.94,33.02 v27.94,27.94 | 34.29,36.2 v34.29,33.02 v34.29,27.94 | 40.64,36.2 v40.64,33.02 v40.64,27.94 | 46.99,36.2 v46.99,33.02 v46.99,27.94 | 53.34,36.2 v53.34,33.02 v53.34,27.94 53.34,22.86 50.8,22.86 MAINBOARD.5 | 59.69,36.2 v59.69,33.02 v59.69,27.94 | 66.04,36.2 v66.04,33.02 v66.04,27.94 | 72.39,36.2 v72.39,33.02 v72.39,27.94 | 78.74,36.2 v78.74,33.02 v78.74,27.94 | 85.09,36.2 v85.09,33.02 v85.09,27.94 | 91.44,36.2 v91.44,33.02 v91.44,27.94 | 97.79,36.2 v97.79,33.02 v97.79,27.94
5V  (via drill 0.32)
  Top 0.254: U5.8 1.59,40.31 | 1.59,40.31 v1.59,39.61 | U6.8 7.94,40.31 | U7.8 14.29,40.31 v14.29,39.61 | U8.8 20.64,40.31 v20.64,39.61 | U9.8 26.99,40.31 v26.99,39.61 | U10.8 33.34,40.31 v33.34,39.61 | U11.8 39.69,40.31 v39.69,39.61 | U12.8 46.04,40.31 v46.04,39.61 | U15.8 52.39,40.31 v52.39,39.61 | U16.8 58.74,40.31 v58.74,39.61 | U17.8 65.09,40.31 v65.09,39.61 | U18.8 71.44,40.31 v71.44,39.61 | U19.8 77.79,39.99 v77.79,39.61 | U20.8 84.14,40.31 v84.14,39.61 | U21.8 90.49,40.31 v90.49,39.61 | U22.8 96.84,40.31 v96.84,39.61 | R1.2 62.23,7.94 58.58,7.94 57.15,6.51 IC2.16 57.78,5.71 C3.2 | 1.59,40.31 1.3,40.31 1.3,40.27 | U14.16 28.1,21.11 C1.2
  Top 0.318: v7.94,39.61 U6.8
  Top 0.457: U14.16 24.13,20.32 22.86,19.05 v21.59,19.05
  Bottom 0.254: C2.2 U13.16 | C5.2 80.64,21.27 U23.16 | C4.2 92.08,21.75 U24.16
  Bottom 0.457: U13.16 17.14,20.32 18.41,19.05 v21.59,19.05 21.59,12.06 20.95,11.43 17.78,11.43 17.78,6.35 35.56,6.35 37.47,8.26 40.01,8.26 IC2.10
  Bottom 0.508: v1.59,39.61 v7.94,39.61 v14.29,39.61 v20.64,39.61 v26.99,39.61 v33.34,39.61 v39.69,39.61 v46.04,39.61 v52.39,39.61 v58.74,39.61 v65.09,39.61 v71.44,39.61 v77.79,39.61 v84.14,39.61 v90.49,39.61 v96.84,39.61 101.6,38.73 101.6,15.88 93.98,15.88 | 93.98,15.88 93.98,1.11 82.55,1.11 | 82.55,1.11 57.15,1.11 IC2.16 57.15,8.26 53.34,12.06 53.34,16.51 | U23.16 82.55,20.32 82.55,1.11 | U24.16 92.71,20.32 93.98,19.05 93.98,15.88 | MAINBOARD.6 53.34,16.51 | IC2.10 41.91,3.17 53.34,3.17 53.34,8.26 50.8,10.79 50.8,16.51 53.34,16.51
DEMUX_IN
  Top 0.254: U14.3 25.4,15.24 26.67,13.97 38.1,13.97 38.1,22.23 48.26,22.23 | 48.26,22.23 59.69,22.23 63.5,18.41 67.31,18.41 70.48,15.24 U23.3 78.74,15.24 80.01,13.97 81.28,13.97 82.55,15.24 U24.3 | 48.26,22.23 MAINBOARD.4
  Bottom 0.254: U13.3 10.79,15.24 12.06,16.51 18.41,16.51 U14.3
GND  (via drill 0.32)
  Top 0.254: v6.54,42.99 U5.4 | v12.57,42.86 U6.4 | v18.92,42.86 U7.4 | U8.4 v25.27,42.86 | U9.4 v31.62,42.86 | v37.97,42.86 U10.4 | v44.32,42.86 U11.4 | v50.67,42.86 U12.4 | v57.02,42.86 U15.4 | U16.4 v63.37,42.86 | v69.72,42.86 U17.4 | v76.07,42.86 U18.4 | v82.42,42.86 U19.4 | v88.14,42.86 U20.4 | v95.12,42.99 U21.4 | v101.28,42.99 U22.4 | LED1.C 58.94,10.2 57.78,8.89 49.53,8.89 | IC2.13 49.53,8.89 | 49.53,8.89 40.64,8.89 v39.37,10.16
  pour Bottom (isolate 0.254): 0,48.9 0,0 102.87,0 102.87,48.9
GNDLINK  (via drill 0.32)
  Top 0.254: v99.06,37.47 v99.06,43.5
N$1
  Top 0.254: LED1.A 62.19,10.17 R1.1
N$2
  Top 0.254: U15.2 55.32,40.95 55.32,39.39 56.81,38.76 56.83,38.73 56.83,30.53 R2.1 | R3.2 R2.1 | 55.55,29.17 R2.1
N$3
  Top 0.254: U15.6 53.66,41.6 53.66,38.89 52.39,38.89 52.39,35.24 54.56,35.24 R5.1 R4.2
N$4
  Top 0.254: U16.2 61.8,40.95 61.8,39.34 63.16,38.71 63.18,38.73 63.18,30.53 R7.1 | R6.2 R7.1 | 61.9,29.25 R7.1
N$5
  Top 0.254: U16.6 60.01,41.6 60.01,38.89 58.74,38.89 58.74,35.24 60.96,35.24 60.96,35.19 R9.1 R8.2
N$6
  Top 0.254: U17.2 68.34,40.95 68.34,39.42 69.49,38.78 69.53,38.73 69.53,30.48 69.48,30.48 R10.1 R11.2
N$7
  Top 0.254: U17.6 66.36,41.6 66.36,38.89 65.09,38.89 65.09,35.24 67.26,35.24 R13.1 R12.2
N$8
  Top 0.254: U18.2 74.36,40.95 74.36,39.42 75.84,38.78 75.88,38.73 75.88,30.53 R15.1 R14.2
N$9
  Top 0.254: U18.6 72.71,41.6 72.71,38.89 71.44,38.89 71.44,35.24 73.61,35.24 R51.1 R48.2
N$10
  Top 0.254: U19.2 81.05,40.95 81.05,39.44 82.16,38.8 82.23,38.73 82.23,30.53 R55.1 R52.2
N$11
  Top 0.254: U19.6 78.9,41.6 78.9,38.89 77.79,38.89 77.79,35.24 79.96,35.24 R59.1 R56.2
N$12
  Top 0.254: U20.2 87.38,40.95 87.38,39.36 88.57,38.73 88.58,38.73 88.58,30.53 R63.1 R60.2
N$13
  Top 0.254: U20.6 85.25,41.6 85.25,38.89 84.14,38.89 84.14,35.24 86.31,35.24 R67.1 R64.2
N$14
  Top 0.254: U21.2 93.84,40.95 93.84,39.42 93.89,39.37 94.93,38.73 94.93,30.48 94.56,30.16 R71.1 R68.2
N$15
  Top 0.254: U21.6 92.08,41.6 92.08,38.89 90.49,38.89 90.49,35.24 92.66,35.24 R75.1 R72.2
N$16
  Top 0.254: U22.2 100.1,40.95 100.1,39.47 101.28,38.83 101.28,30.85 R80.1 R76.2
N$17
  Top 0.254: U22.6 97.95,41.6 97.95,38.89 96.84,38.89 96.84,35.24 99.01,35.24 R81.1 R79.2
N$18
  Top 0.254: U5.2 4.87,40.95 4.87,39.38 4.88,39.37 6.03,38.73 6.03,30.8 4.71,29.48 R82.1 R16.2
N$19
  Top 0.254: U5.6 2.86,41.6 2.86,38.89 1.27,38.89 1.27,35.24 3.76,35.24 R83.1 R19.2
N$20
  Top 0.254: U6.2 11.14,40.95 11.14,39.43 12.32,38.8 12.38,38.73 12.38,30.53 R84.1 R20.2
N$21
  Top 0.254: U6.6 9.13,41.6 9.13,38.89 7.94,38.89 7.94,35.24 10.11,35.24 R85.1 R23.2
N$22
  Top 0.254: U7.2 17.51,40.95 17.51,39.35 18.71,38.72 18.73,38.73 18.73,30.53 R24.1 R86.2
N$23
  Top 0.254: U7.6 15.48,41.6 15.48,38.89 14.29,38.89 14.29,35.24 16.14,35.24 R87.1 R27.2
N$24
  Top 0.254: U5.1 6,40.31 6,40.03 6.67,38.73 6.67,25.4 3.81,25.4 | R82.2 3.81,29.21 3.81,25.4 | 3.81,25.4 3.81,13.97 12.06,13.97 U13.14
N$25
  Top 0.191: 0.91,34.17 0.64,34.17 0.64,40.96 0.95,40.96
  Top 0.254: U5.7 0.95,40.95 0.95,40.96 | R83.2 1.35,34.29 0.91,34.17 1.27,34.17 1.27,11.43 12.06,11.43 U13.13
N$26
  Top 0.254: U6.1 12.35,40.31 12.35,40.03 13.02,38.73 13.02,26.99 11.43,25.4 | R84.2 10.16,29.21 10.16,25.4 11.43,25.4 | U13.12 14.61,11.43 14.61,19.05 12.06,19.05 11.43,19.68 11.43,25.4
N$27
  Top 0.254: U8.2 23.84,40.95 23.84,39.4 25.06,38.76 25.08,38.73 25.08,30.53 R88.1 R28.2
N$28
  Top 0.254: 4.45,41.6 U5.3 4.45,41.59 | 4.45,41.6 4.13,41.6 4.13,38.1 5.4,38.1 R17.1 | SENSORPANEL-0-16.2 13.46,45.09 11.75,45.09 10.48,43.81 6.03,43.81 4.76,42.55 4.76,41.59 4.46,41.59 4.45,41.6
N$29
  Top 0.254: 3.49,42.23 3.49,38.1 2.22,38.1 R18.1 | 3.49,42.23 3.81,42.23 3.81,42.55 7.62,46.35 11.94,46.35 SENSORPANEL-0-16.1 | 3.49,42.23 3.49,42.24 U5.5
N$30
  Top 0.254: U8.6 21.91,41.6 21.91,38.89 20.64,38.89 20.64,35.24 22.49,35.24 R89.1 R31.2
N$31
  Top 0.191: 7.98,40.96 6.99,40.96 6.99,39.69 7.26,39.41
  Top 0.254: 7.98,40.96 U6.7 | U13.15 13.34,17.72 12.7,17.78 11.43,17.78 7.62,21.59 7.62,34.29 7.7,34.29 | R85.2 7.7,34.29 | 7.26,39.41 7.26,34.72 7.7,34.29
N$32
  Top 0.254: U9.2 30.22,40.95 30.22,39.42 31.39,38.78 31.43,38.73 31.43,30.48 31.38,30.48 R32.1 R90.2
N$33
  Top 0.254: 11.11,41.6 U6.3 12.36,41.59 | 11.11,41.6 10.48,41.6 10.48,38.1 11.11,38.1 11.11,38.05 R21.1 | 11.11,41.6 11.11,42.55 12.38,43.81 16.83,43.81 19.05,46.04 19.49,46.04 SENSORPANEL-0-16.4
N$34
  Top 0.254: R22.1 9.84,38.05 9.84,42.23 | 9.84,42.23 7.98,42.23 U6.5 | 9.84,42.23 12.06,44.45 16.51,44.45 16.51,45.85 SENSORPANEL-0-16.3
N$35
  Top 0.254: U9.6 28.26,41.6 28.26,38.89 26.99,38.89 26.99,35.24 28.84,35.24 R91.1 R35.2
N$36
  Top 0.254: R24.2 16.51,29.21 16.51,25.72 | U13.5 6.99,8.89 13.97,8.89 16.51,11.43 16.51,25.72 | U7.1 18.69,40.04 19.37,39.05 19.37,26.35 18.73,25.72 16.51,25.72
N$37  (via drill 0.32)
  Top 0.191: 13.65,39.26 13.34,39.69 13.34,40.96 14.33,40.96
  Top 0.254: 14.33,40.96 U7.7 | R87.2 13.65,34.29 | 13.65,34.29 13.65,39.26 | 13.65,34.29 v13.65,26.04
  Bottom 0.254: U13.1 7.3,20.32 v13.65,26.04
N$38
  Top 0.254: U10.2 36.6,40.95 36.6,39.42 37.74,38.78 37.78,38.73 37.78,30.53 R36.1 R92.2
N$39
  Top 0.254: R25.1 16.83,38.05 16.83,41.59 17.46,41.59 | 17.46,41.59 18.69,41.59 U7.3 17.46,41.59 | 17.46,41.59 17.46,42.55 18.41,43.5 22.54,43.5 24.77,45.72 SENSORPANEL-0-16.6
N$40
  Top 0.254: R26.1 16.19,38.05 16.19,42.23 | 16.19,42.23 14.92,42.23 | 14.92,42.23 14.92,42.24 U7.5 14.63,42.23 14.92,42.23 | 16.19,42.23 18.1,44.13 21.27,44.13 22.23,45.09 SENSORPANEL-0-16.5
N$41
  Top 0.254: U10.6 34.61,41.6 34.61,38.89 33.34,38.89 33.34,35.24 35.19,35.24 R93.1 R39.2
N$42  (via drill 0.32)
  Top 0.254: U8.1 25.04,40.04 25.72,38.73 25.72,25.4 24.13,25.4 | 24.13,25.4 22.86,25.4 22.86,29.21 R88.2 | 24.13,25.4 v24.13,23.5
  Bottom 0.254: U13.4 3.17,12.7 3.17,16.51 6.99,16.51 14.61,23.5 v24.13,23.5
N$43  (via drill 0.32)
  Top 0.191: 20,39.37 19.68,39.69 19.68,40.96 20,40.96
  Top 0.254: 20.07,34.17 20,34.17 20,39.37 | U8.7 20,40.95 20,40.96 | 20.07,34.17 v20.07,24.77 | R89.2 20.18,34.29 20.07,34.17
  Bottom 0.254: v20.07,24.77 13.97,24.77 6.35,17.78 U13.2
N$44
  Top 0.254: U11.2 42.97,40.95 42.97,39.39 44.11,38.76 44.13,38.73 44.13,30.53 R94.1 R40.2
N$45  (via drill 0.32)
  Top 0.254: 31.41,40.31 U9.1 31.39,40.04 32.07,38.73 v32.07,25.4 29.21,25.4 29.21,29.21 R32.2
  Bottom 0.254: U14.14 32.07,15.24 v32.07,25.4
N$46
  Top 0.254: U8.5 22.54,42.24 | 22.54,42.24 22.54,38.1 21.27,38.1 R30.1 | 22.54,42.24 22.54,42.55 24.13,44.13 24.96,44.13 SENSORPANEL-0-16.7
N$47
  Top 0.254: U12.2 49.31,40.95 49.31,39.37 50.48,38.73 50.48,30.53 R96.1 R44.2
N$48
  Top 0.254: R29.1 23.18,38.05 23.18,41.59 23.81,41.59 | 23.81,41.59 25.04,41.59 U8.3 23.82,41.6 23.81,41.59 | 23.81,41.59 23.81,42.86 24.45,43.5 28.26,43.5 29.84,45.09 SENSORPANEL-0-16.8
N$49  (via drill 0.32)
  Top 0.191: 26.35,39.37 26.04,39.69 26.04,40.96 26.35,40.96
  Top 0.254: 26.35,39.37 26.35,34.17 26.67,34.17 | U9.7 26.35,40.95 26.35,40.96 | R91.2 26.79,34.29 26.67,34.17 | 26.67,34.17 v26.67,25.4
  Bottom 0.254: v26.67,25.4 26.67,22.23 24.77,20.32 24.77,13.34 25.4,12.7 U14.13
N$50
  Top 0.254: U12.6 47.31,41.6 47.31,38.89 46.04,38.89 46.04,35.24 47.89,35.24 R97.1 R47.2
N$51
  Top 0.254: 28.89,42.24 28.89,42.86 32.38,46.35 SENSORPANEL-0-16.9 | 28.89,42.23 27.65,42.23 U9.5 28.89,42.24 | 28.89,42.24 28.89,42.23 | 28.89,42.23 28.89,38.1 27.62,38.1 R34.1
N$53
  Top 0.254: R33.1 30.8,38.1 29.53,38.1 29.53,41.6 U9.3 30.18,41.6 30.16,41.59 30.16,42.55 31.43,43.81 32.51,43.81 SENSORPANEL-0-16.10
N$54  (via drill 0.32)
  Top 0.254: 37.77,40.31 U10.1 37.74,40.04 38.42,38.73 38.42,25.4 v35.56,25.4 35.56,29.21 R36.2
  Bottom 0.254: U14.12 33.66,10.16 33.66,23.5 v35.56,25.4
N$55  (via drill 0.32)
  Top 0.191: 32.7,39.37 32.38,39.69 32.38,40.96 33.38,40.96
  Top 0.254: 32.7,39.37 32.7,34.49 v33.02,34.29 | 33.38,40.96 U10.7 | R93.2 v33.02,34.29 | v33.02,34.29 32.95,34.29
  Bottom 0.254: U14.15 26.04,17.78 26.04,13.97 32.7,13.97 32.7,33.97 v33.02,34.29
N$57
  Top 0.254: 35.24,42.24 35.24,44.13 37.47,46.35 SENSORPANEL-0-16.11 | 35.24,42.24 U10.5 | 35.24,42.24 35.24,38.1 33.97,38.1 R38.1
N$59
  Top 0.254: U10.3 36.2,41.6 | 36.2,41.6 35.88,41.6 35.88,38.1 37.15,38.1 R37.1 | U10.3 38.1,41.6 38.1,41.59 | 37.76,41.59 U10.3 | SENSORPANEL-0-16.12 39.88,46.23 36.2,42.55 36.2,41.6
N$60  (via drill 0.32)
  Top 0.254: U11.1 44.09,40.04 44.77,38.73 44.77,26.67 43.5,25.4 v41.91,25.4 41.91,29.21 R94.2
  Bottom 0.254: U14.5 20.95,8.89 36.2,8.89 36.2,23.5 40.01,23.5 v41.91,25.4
N$61
  Top 0.191: 39.05,39.37 38.73,39.69 38.73,40.96 39.73,40.96
  Top 0.254: 39.05,34.17 39.05,39.37 | 39.73,40.96 U11.7 | 39.05,34.17 39.12,34.17 39.23,34.29 R95.2 | U14.1 19.68,22.23 25.72,22.23 28.26,24.77 39.05,24.77 39.05,34.17
N$63
  Top 0.254: 41.59,42.24 41.59,45.4 42.55,46.35 SENSORPANEL-0-16.13 | 41.59,42.24 U11.5 | 41.59,42.24 41.59,38.1 40.32,38.1 R42.1
N$64
  Top 0.254: U11.6 40.96,41.6 40.96,38.89 39.69,38.89 39.69,35.24 41.86,35.24 R95.1 R43.2
N$65
  Top 0.254: U11.3 44.11,41.59 42.86,41.59 | 42.86,41.59 42.23,41.59 42.23,38.1 43.5,38.1 R41.1 | 42.86,41.59 42.86,44.01 SENSORPANEL-0-16.14
N$66
  Top 0.254: 50.4,40.31 U12.1 50.44,40.04 51.12,38.73 51.12,26.67 49.85,25.4 48.26,25.4 | 48.26,25.4 48.26,29.21 R96.2 | 48.26,25.4 46.35,23.18 34.92,23.18 34.92,16.51 18.41,16.51 18.41,12.7 U14.4
N$67
  Top 0.191: U12.7 45.1,40.95 45.09,40.96 45.09,39.69 45.4,39.37
  Top 0.254: 45.4,39.37 45.4,34.29 45.72,34.29 | R97.2 45.72,34.29 | 45.72,34.29 45.72,26.67 43.18,24.13 29.37,24.13 29.37,19.05 26.04,19.05 24.77,17.78 U14.2
N$69
  Top 0.254: SENSORPANEL-0-16.15 47.62,46.04 47.94,45.72 47.94,42.28 U12.5 47.94,42.24 47.94,38.1 46.67,38.1 R46.1
N$71
  Top 0.254: R45.1 49.85,38.1 48.58,38.1 48.58,41.6 U12.3 50.46,41.59 49.21,41.59 49.21,42.86 50.16,43.81 SENSORPANEL-0-16.16
N$72  (via drill 0.32)
  Top 0.254: 56.76,40.31 U15.1 56.79,40.04 57.47,38.73 57.47,29.53 56.52,28.57 56.52,25.4 55.56,25.4 | 55.56,25.4 54.61,25.4 54.61,29.21 R2.2 | 55.56,25.4 v55.56,24.45
  Bottom 0.254: U23.14 73.03,22.86 55.56,22.86 v55.56,24.45
N$73
  Top 0.254: U13.11 14.61,6.35 27.3,6.35 | U14.11 27.3,6.35 | 27.3,6.35 36.2,6.35 38.1,4.45 54.61,4.45 | 54.61,4.45 64.14,4.45 66.04,6.35 80.64,6.35 | U23.11 80.64,6.35 | 80.64,6.35 90.17,6.35 91.44,7.62 U24.11 | IC2.15 54.61,4.45
N$74  (via drill 0.32)
  Top 0.254: U13.10 14.61,3.81 27.3,3.81 | U14.10 27.3,3.81 | 27.3,3.81 36.83,3.81 37.47,3.17 64.77,3.17 65.41,3.81 v71.12,3.81 80.64,3.81 | U23.10 80.64,3.81 | 80.64,3.81 90.17,3.81 91.44,5.08 U24.10
  Bottom 0.254: v71.12,3.81 71.12,6.99 64.14,13.97 IC2.1
N$75  (via drill 0.32)
  Top 0.254: 80.64,1.27 67.94,1.27 v66.67,2.54 66.04,1.91 27.94,1.91 U14.9 26.04,1.27 14.61,1.27 U13.9 | U23.9 80.64,1.27 | 80.64,1.27 90.17,1.27 91.44,2.54 U24.9 | IC2.2 54.61,12.7 55.24,12.06 64.14,12.06 66.67,9.53 v66.67,7.62
  Bottom 0.254: 80.64,2.41 U23.9 | v66.67,7.62 v66.67,2.54
N$76
  Bottom 0.254: IC2.3 52.07,11.43 55.88,7.62 55.88,1.27 12.06,1.27 U13.6
N$77
  Top 0.254: IC2.4 49.53,12.7 48.26,11.43 36.2,11.43 33.66,8.89 26.67,8.89 25.4,7.62 U14.6
N$78  (via drill 0.32)
  Top 0.191: U15.7 51.45,40.95 51.44,40.96 51.44,39.69 51.75,39.37
  Top 0.254: 51.75,39.37 51.75,34.29 | R5.2 51.75,34.29 | 51.75,34.29 51.75,25.4 53.66,23.5 60.33,23.5 64.14,19.68 68.58,19.68 v69.85,18.41
  Bottom 0.254: v69.85,18.41 71.75,16.51 76.2,16.51 80.01,12.7 U23.13
N$80
  Top 0.254: 56.79,41.59 U15.3 | 56.81,41.59 U15.3 | 56.81,41.59 55.56,41.59 | R49.1 56.2,38.1 54.61,38.1 54.61,41.59 | SENSORPANEL-16-31.2 54.61,45.09 54.61,41.59 | 57.47,41.59 56.81,41.59 | 54.61,41.59 56.78,41.59 U15.3
N$81
  Top 0.254: R50.1 54.13,38.05 54.13,42.23 52.7,42.23 | 52.7,42.23 52.43,42.23 U15.5 52.69,42.24 52.7,42.23 | 52.7,42.23 SENSORPANEL-16-31.1
N$83  (via drill 0.32)
  Top 0.254: 63.17,40.31 U16.1 63.14,40.04 63.82,38.73 v63.82,25.4 60.96,25.4 60.96,29.21 R7.2
  Bottom 0.254: v63.82,25.4 66.04,24.77 74.3,24.77 80.01,19.05 81.92,19.05 81.92,11.43 U23.12
N$84  (via drill 0.32)
  Top 0.191: U16.7 57.8,40.95 57.78,40.96 57.78,39.69 58.1,39.37
  Top 0.254: 58.1,39.37 58.1,34.29 | R9.2 58.1,34.29 | 58.1,34.29 v58.1,27.94
  Bottom 0.254: U23.15 80.01,17.78 73.66,24.13 58.1,24.13 v58.1,27.94
N$86
  Top 0.254: R53.1 61.33,38.05 61.28,38.1 61.28,41.59 | 61.28,41.59 63.13,41.59 U16.3 61.29,41.6 61.28,41.59 | 61.28,41.59 61.28,45.28 SENSORPANEL-16-31.4
N$87
  Top 0.254: R54.1 60.48,38.05 60.48,42.23 58.78,42.23 U16.5 59.37,42.28 59.37,44.45 57.78,46.04 SENSORPANEL-16-31.3
N$89  (via drill 0.32)
  Top 0.254: 69.41,40.31 U17.1 69.49,40.04 70.17,38.73 70.17,25.4 68.58,25.4 | 68.58,25.4 67.31,25.4 67.31,29.21 R10.2 | 68.58,25.4 v68.58,21.91
  Bottom 0.254: U23.5 71.75,10.16 68.58,13.34 v68.58,21.91
N$90
  Top 0.191: U17.7 64.15,40.95 64.14,40.96 64.14,39.69 64.45,39.37
  Top 0.254: 64.45,39.37 64.45,34.29 65.09,34.29 | R13.2 65.09,34.29 | 65.09,34.29 65.09,20.95 72.39,20.95 U23.1
N$92
  Top 0.254: U17.3 69.51,41.59 67.31,41.59 | 67.31,41.59 67.31,38.1 68.9,38.1 R57.1 | SENSORPANEL-16-31.6 65.41,45.09 67.31,43.18 67.31,41.59
N$93
  Top 0.254: R58.1 65.72,38.1 66.83,38.1 66.83,42.24 U17.5 65.72,42.28 65.72,43.18 62.87,46.04 SENSORPANEL-16-31.5
N$95  (via drill 0.32)
  Top 0.254: U18.1 75.84,40.04 76.52,38.73 76.52,26.35 75.56,25.4 73.66,25.4 | R15.2 73.66,29.21 73.66,25.4 | 73.66,25.4 76.2,22.86 76.2,16.51 v70.48,16.51
  Bottom 0.254: v70.48,16.51 70.48,13.97 71.75,12.7 U23.4
N$96
  Top 0.191: U18.7 70.5,40.95 70.48,40.96 70.48,39.69 70.8,39.37
  Top 0.254: 70.8,39.37 70.8,34.29 | R51.2 70.8,34.29 | 70.8,34.29 70.8,25.72 74.3,22.23 74.3,19.05 U23.2
N$98
  Top 0.254: SENSORPANEL-16-31.7 67.94,45.77 69.22,44.45 69.85,44.45 71.12,43.18 71.12,42.24 U18.5 73.18,42.24 73.18,38.1 72.07,38.1 R62.1
N$100
  Top 0.254: SENSORPANEL-16-31.8 70.61,46.23 73.66,42.55 73.66,41.59 | U18.3 75.86,41.59 73.66,41.59 | 73.66,41.59 73.66,38.1 75.25,38.1 R61.1
N$101  (via drill 0.32)
  Top 0.254: 82.56,40.31 U19.1 82.87,38.73 82.87,25.4 81.92,25.4 | 81.92,25.4 80.01,25.4 80.01,29.21 R55.2 | 81.92,25.4 v81.92,24.77
  Bottom 0.254: v81.92,24.77 90.17,24.77 90.17,16.51 91.44,15.24 U24.14
N$102  (via drill 0.32)
  Top 0.191: U19.7 76.85,40.95 76.83,40.96 76.83,39.69 77.15,39.37
  Top 0.254: 77.15,39.37 77.15,34.29 | R59.2 77.15,34.29 | 77.15,34.29 v77.15,24.77
  Bottom 0.254: U24.13 91.44,12.7 88.27,15.88 88.27,23.97 77.79,23.97 v77.15,24.77
N$104
  Top 0.254: R66.1 78.42,38.1 79.38,38.1 79.38,42.23 78.42,42.23 78.42,42.24 U19.5 76.89,43.81 75.56,43.81 73.03,46.35 SENSORPANEL-16-31.9
N$106
  Top 0.254: 82.21,41.59 U19.3 80.49,41.6 | 80.49,41.6 80.49,38.1 81.6,38.1 R65.1 | 80.49,41.6 80.01,41.6 80.01,42.55 79.38,43.18 78.74,43.18 75.73,46.23 SENSORPANEL-16-31.10
N$107  (via drill 0.32)
  Top 0.254: U20.1 89.22,38.73 89.22,25.4 86.36,25.4 | v86.36,22.23 86.36,25.4 | 86.36,25.4 86.36,29.21 R63.2
  Bottom 0.254: U24.12 91.44,10.16 86.36,15.24 v86.36,22.23
N$108
  Top 0.191: U20.7 83.2,40.95 83.19,40.96 83.19,39.69 83.5,39.37
  Top 0.254: 83.5,39.37 83.5,34.29 84.14,34.29 | R67.2 84.14,34.29 | 84.14,34.29 84.14,25.72 83.19,24.77 83.19,16.51 90.17,16.51 91.44,17.78 U24.15
N$110
  Top 0.254: U20.5 84.77,42.24 84.77,42.23 | R70.1 85.67,38.05 85.72,38.1 85.72,42.23 84.19,42.23 U20.5 | U20.5 84.12,42.24 82.55,43.81 80.64,43.81 78.74,45.72 78.11,45.72 SENSORPANEL-16-31.11
N$112
  Top 0.254: SENSORPANEL-16-31.12 80.77,46.23 82.55,44.45 83.82,44.45 85.09,43.18 85.72,43.18 86.36,42.55 86.36,41.59 88.53,41.59 U20.3 86.84,41.6 86.84,38.1 87.95,38.1 R69.1
N$113  (via drill 0.32)
  Top 0.254: 94.93,40.31 U21.1 95.57,38.73 95.57,25.4 93.98,25.4 | 93.98,25.4 92.71,25.4 92.71,29.21 R71.2 | U24.5 85.72,8.89 93.98,8.89 97.16,12.06 v97.16,19.05 | 93.98,25.4 v93.98,24.77
  Bottom 0.254: v97.16,19.05 97.16,24.77 v93.98,24.77
N$114
  Top 0.191: U21.7 89.55,40.95 89.53,40.96 89.53,39.69 89.85,39.37
  Top 0.254: 89.85,39.37 89.85,34.29 90.49,34.29 | R75.2 90.49,34.29 | 90.49,34.29 90.49,24.13 85.72,20.32 U24.1
N$116
  Top 0.254: R74.1 92.71,38.05 92.71,42.23 91.12,42.23 91.12,42.24 U21.5 90.16,42.24 89.85,42.55 88.63,43.81 87,43.81 86.36,44.45 85.09,44.45 83.19,46.35 SENSORPANEL-16-31.13
N$118
  Top 0.254: U21.3 93.34,41.6 | 93.34,41.6 93.34,41.59 | 93.34,41.59 93.34,38.1 94.3,38.1 R73.1 | 93.34,41.6 93.34,42.55 92.71,43.18 90.81,43.18 89.53,44.45 87.63,44.45 85.85,46.23 SENSORPANEL-16-31.14 | 93.34,41.59 93.33,41.59 93.34,41.6
N$119
  Top 0.254: U22.1 101.93,40.31 101.92,40.01 101.92,26.67 100.97,25.4 99.06,25.4 | 99.06,25.4 99.06,29.21 R80.2 | 99.06,25.4 99.06,23.5 93.34,18.41 93.34,13.97 85.72,13.97 U24.4
N$120
  Top 0.191: U22.7 95.9,40.95 95.89,40.96 95.89,39.69 96.2,39.37
  Top 0.254: 96.2,39.37 96.2,34.29 96.84,34.29 | R81.2 96.84,34.29 | 96.84,34.29 96.84,25.08 95.82,24.13 92.01,24.13 U24.2
N$122
  Top 0.254: R78.1 98.61,38.05 98.61,42.23 97.47,42.23 97.47,42.24 U22.5 94.67,44.45 90.81,44.45 90.17,45.09 89.38,45.09 88.27,46.35 SENSORPANEL-16-31.15
N$124
  Top 0.254: R77.1 100.65,38.1 99.54,38.1 99.54,41.6 U22.3 101.23,41.59 100.01,41.59 100.01,44.45 98.74,45.72 91.31,45.72 SENSORPANEL-16-31.16
N$125
  Top 0.254: IC2.5 48.9,15.88 64.67,15.88 72.94,7.61 72.94,7.62 U23.6
N$126
  Top 0.254: U24.6 83.19,7.62 81.92,8.89 80.01,8.89 77.47,11.43 71.75,11.43 66.04,17.14 46.35,17.14 44.45,15.24 IC2.6
N$127
  Bottom 0.254: IC2.12 46.99,7.62 45.72,8.89 MAINBOARD.3
SHIFT_CLK
  Bottom 0.254: IC2.11 44.45,10.79 43.18,12.06 MAINBOARD.2
SHIFT_SER
  Bottom 0.254: IC2.14 52.07,4.13 43.18,4.13 43.18,10.16 40.64,12.7 MAINBOARD.1

### Text on the board
tPlace: mainboard connection | P1 | P8 | wiretouch sensor board v1.23 / www.wiretouch.net
bPlace: U5 | U6 | U7 | U8 | U9 | U10 | U11 | U12 | U15 | U16 | U17 | U18 | U19 | U20 | U21 | U22 | 74HC4051N | 74HC4051N | 74HC4051N | 74HC4051N